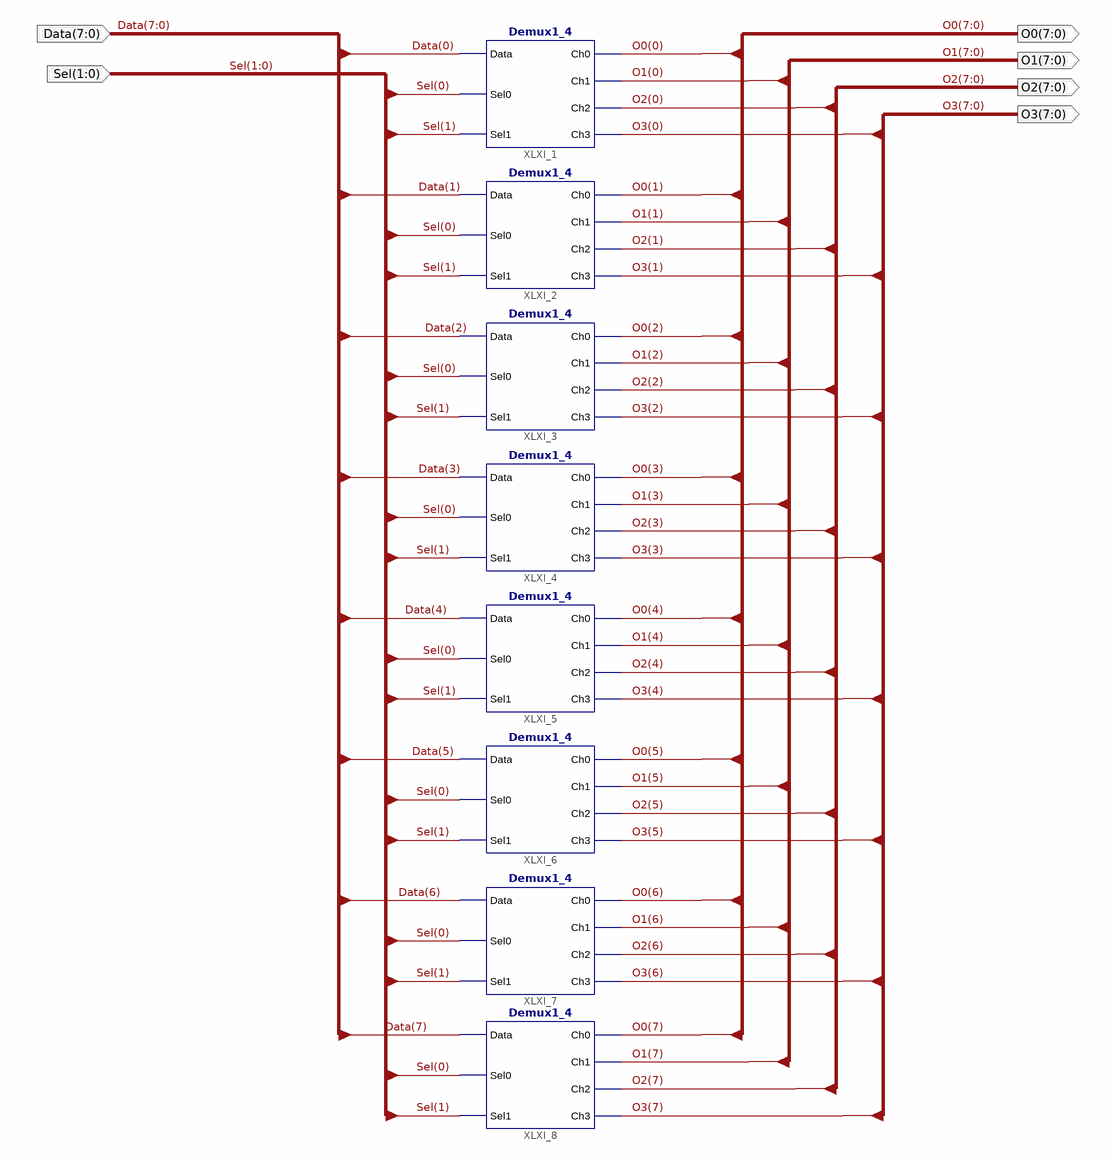
[diagram p0: schematic sheet 1]
// Xilinx ISE schematic Demux1_4_8.sch (spartan6) as structural Verilog: 8 symbols, 6 ports
module Demux1_4_8 (
  input  [7:0] Data,
  input  [1:0] Sel,
  output [7:0] O0,
  output [7:0] O1,
  output [7:0] O2,
  output [7:0] O3
);

  Demux1_4 XLXI_1 (.Data(Data[0]), .Sel0(Sel[0]), .Sel1(Sel[1]), .Ch0(O0[0]), .Ch1(O1[0]), .Ch2(O2[0]), .Ch3(O3[0]));
  Demux1_4 XLXI_2 (.Data(Data[1]), .Sel0(Sel[0]), .Sel1(Sel[1]), .Ch0(O0[1]), .Ch1(O1[1]), .Ch2(O2[1]), .Ch3(O3[1]));
  Demux1_4 XLXI_3 (.Data(Data[2]), .Sel0(Sel[0]), .Sel1(Sel[1]), .Ch0(O0[2]), .Ch1(O1[2]), .Ch2(O2[2]), .Ch3(O3[2]));
  Demux1_4 XLXI_4 (.Data(Data[3]), .Sel0(Sel[0]), .Sel1(Sel[1]), .Ch0(O0[3]), .Ch1(O1[3]), .Ch2(O2[3]), .Ch3(O3[3]));
  Demux1_4 XLXI_5 (.Data(Data[4]), .Sel0(Sel[0]), .Sel1(Sel[1]), .Ch0(O0[4]), .Ch1(O1[4]), .Ch2(O2[4]), .Ch3(O3[4]));
  Demux1_4 XLXI_6 (.Data(Data[5]), .Sel0(Sel[0]), .Sel1(Sel[1]), .Ch0(O0[5]), .Ch1(O1[5]), .Ch2(O2[5]), .Ch3(O3[5]));
  Demux1_4 XLXI_7 (.Data(Data[6]), .Sel0(Sel[0]), .Sel1(Sel[1]), .Ch0(O0[6]), .Ch1(O1[6]), .Ch2(O2[6]), .Ch3(O3[6]));
  Demux1_4 XLXI_8 (.Data(Data[7]), .Sel0(Sel[0]), .Sel1(Sel[1]), .Ch0(O0[7]), .Ch1(O1[7]), .Ch2(O2[7]), .Ch3(O3[7]));
endmodule
